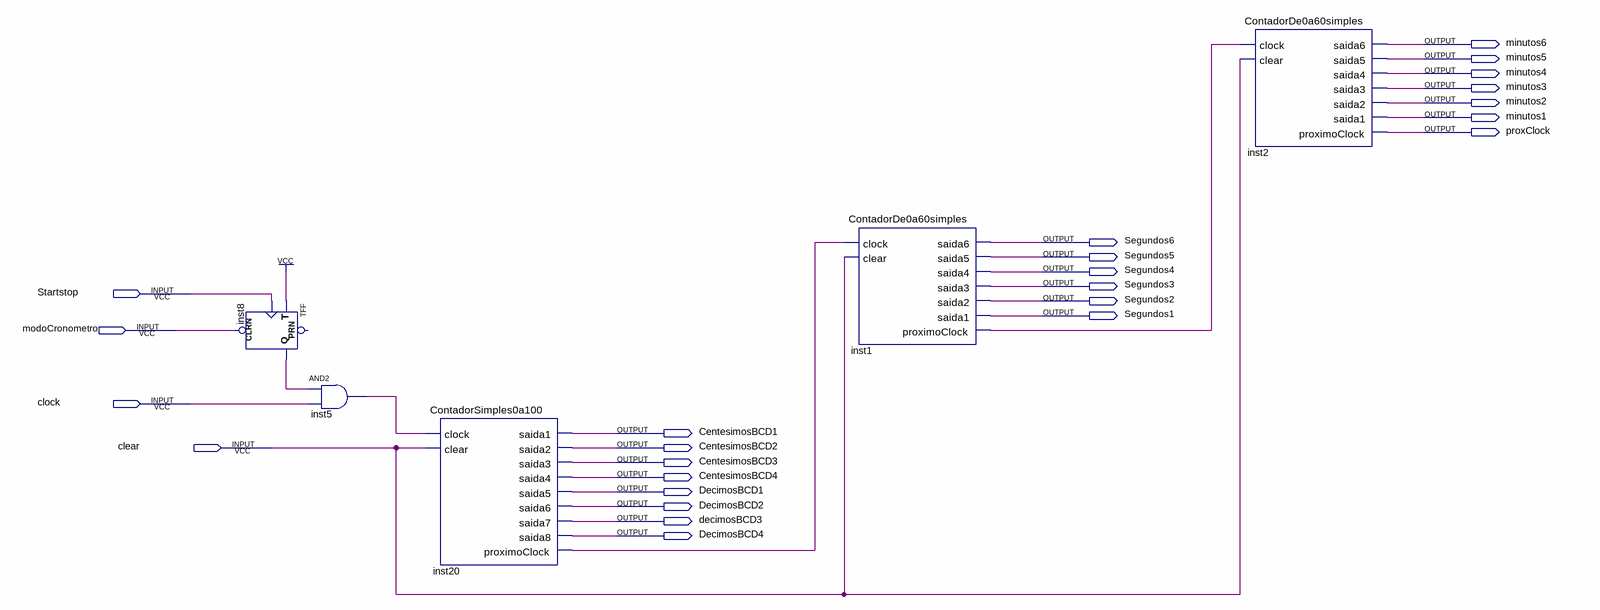
[diagram p0: schematic sheet]
// Quartus schematic Cronometro.bdf as structural Verilog: 5 symbols, 25 pins
module Cronometro (
  input  Startstop,
  input  modoCronometro,
  input  clock,
  input  clear,
  output minutos6,
  output minutos5,
  output minutos4,
  output minutos3,
  output minutos2,
  output minutos1,
  output proxClock,
  output Segundos6,
  output Segundos5,
  output Segundos4,
  output Segundos3,
  output Segundos2,
  output Segundos1,
  output CentesimosBCD1,
  output CentesimosBCD2,
  output CentesimosBCD3,
  output CentesimosBCD4,
  output DecimosBCD1,
  output DecimosBCD2,
  output decimosBCD3,
  output DecimosBCD4
);

  wire inst1_proximoclock, inst5_out, inst8_q, inst20_proximoclock;

  TFF inst8 (.CLRN(modoCronometro), .T(1'b1), .CLK(Startstop), .Q(inst8_q));  // open: PRN
  and inst5 (inst5_out, inst8_q, clock);
  ContadorSimples0a100 inst20 (
    .clock(inst5_out), .clear(clear), .saida1(CentesimosBCD1), .saida2(CentesimosBCD2),
    .saida3(CentesimosBCD3), .saida4(CentesimosBCD4), .saida5(DecimosBCD1), .saida6(DecimosBCD2),
    .saida7(decimosBCD3), .saida8(DecimosBCD4), .proximoClock(inst20_proximoclock));
  ContadorDe0a60simples inst1 (
    .clock(inst20_proximoclock), .clear(clear), .saida6(Segundos6), .saida5(Segundos5), .saida4(Segundos4),
    .saida3(Segundos3), .saida2(Segundos2), .saida1(Segundos1), .proximoClock(inst1_proximoclock));
  ContadorDe0a60simples inst2 (
    .clock(inst1_proximoclock), .clear(clear), .saida6(minutos6), .saida5(minutos5), .saida4(minutos4),
    .saida3(minutos3), .saida2(minutos2), .saida1(minutos1), .proximoClock(proxClock));
endmodule
